# Altium schematic sheet MS1005_Demo_V1.0.SchDoc
size A2; SheetNumber: 0; SheetTotal: 0; PageSetup: Record=PageOptions|CenterHorizontal=False|CenterVertical=True|PrintScale=1.00|XCorrection=1.00|YCorrection=1.00|PrintKind=2|BorderSize=5000000|LeftOffset=0|BottomOffset=0|Orientation=1|PaperLength=1000|PaperWidth=1000|Scale=100|PaperSource=7|PrintQuality=600|MediaType=1|DitherType=10|PaperKind=信纸¦PrintScaleMode=0
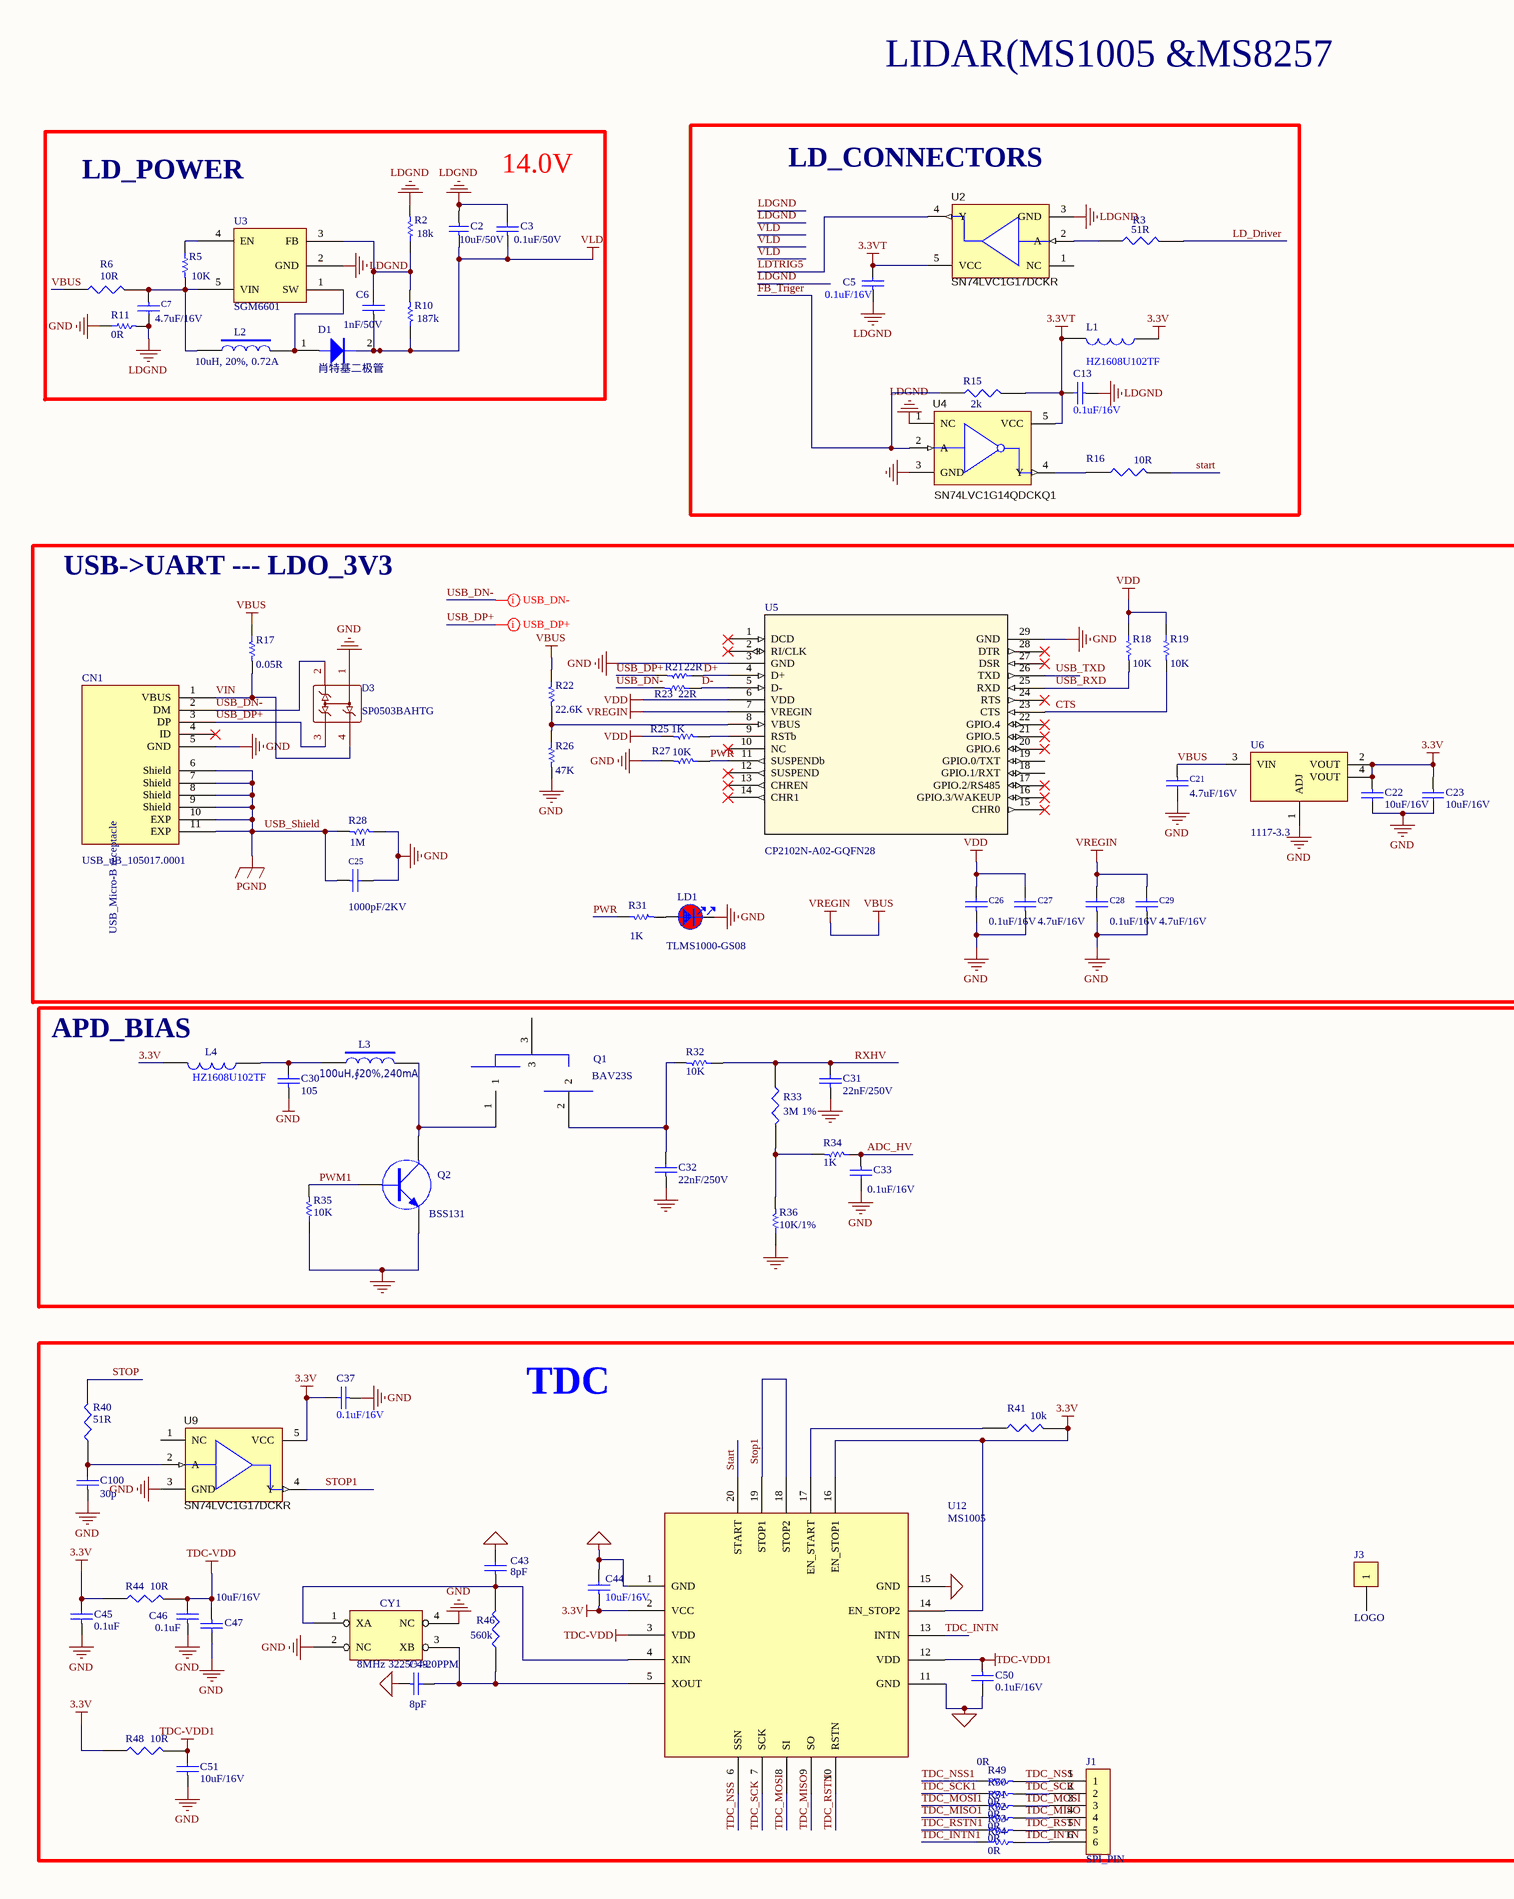
[diagram p0: MS1005_Demo_V1.0.SchDoc, left]
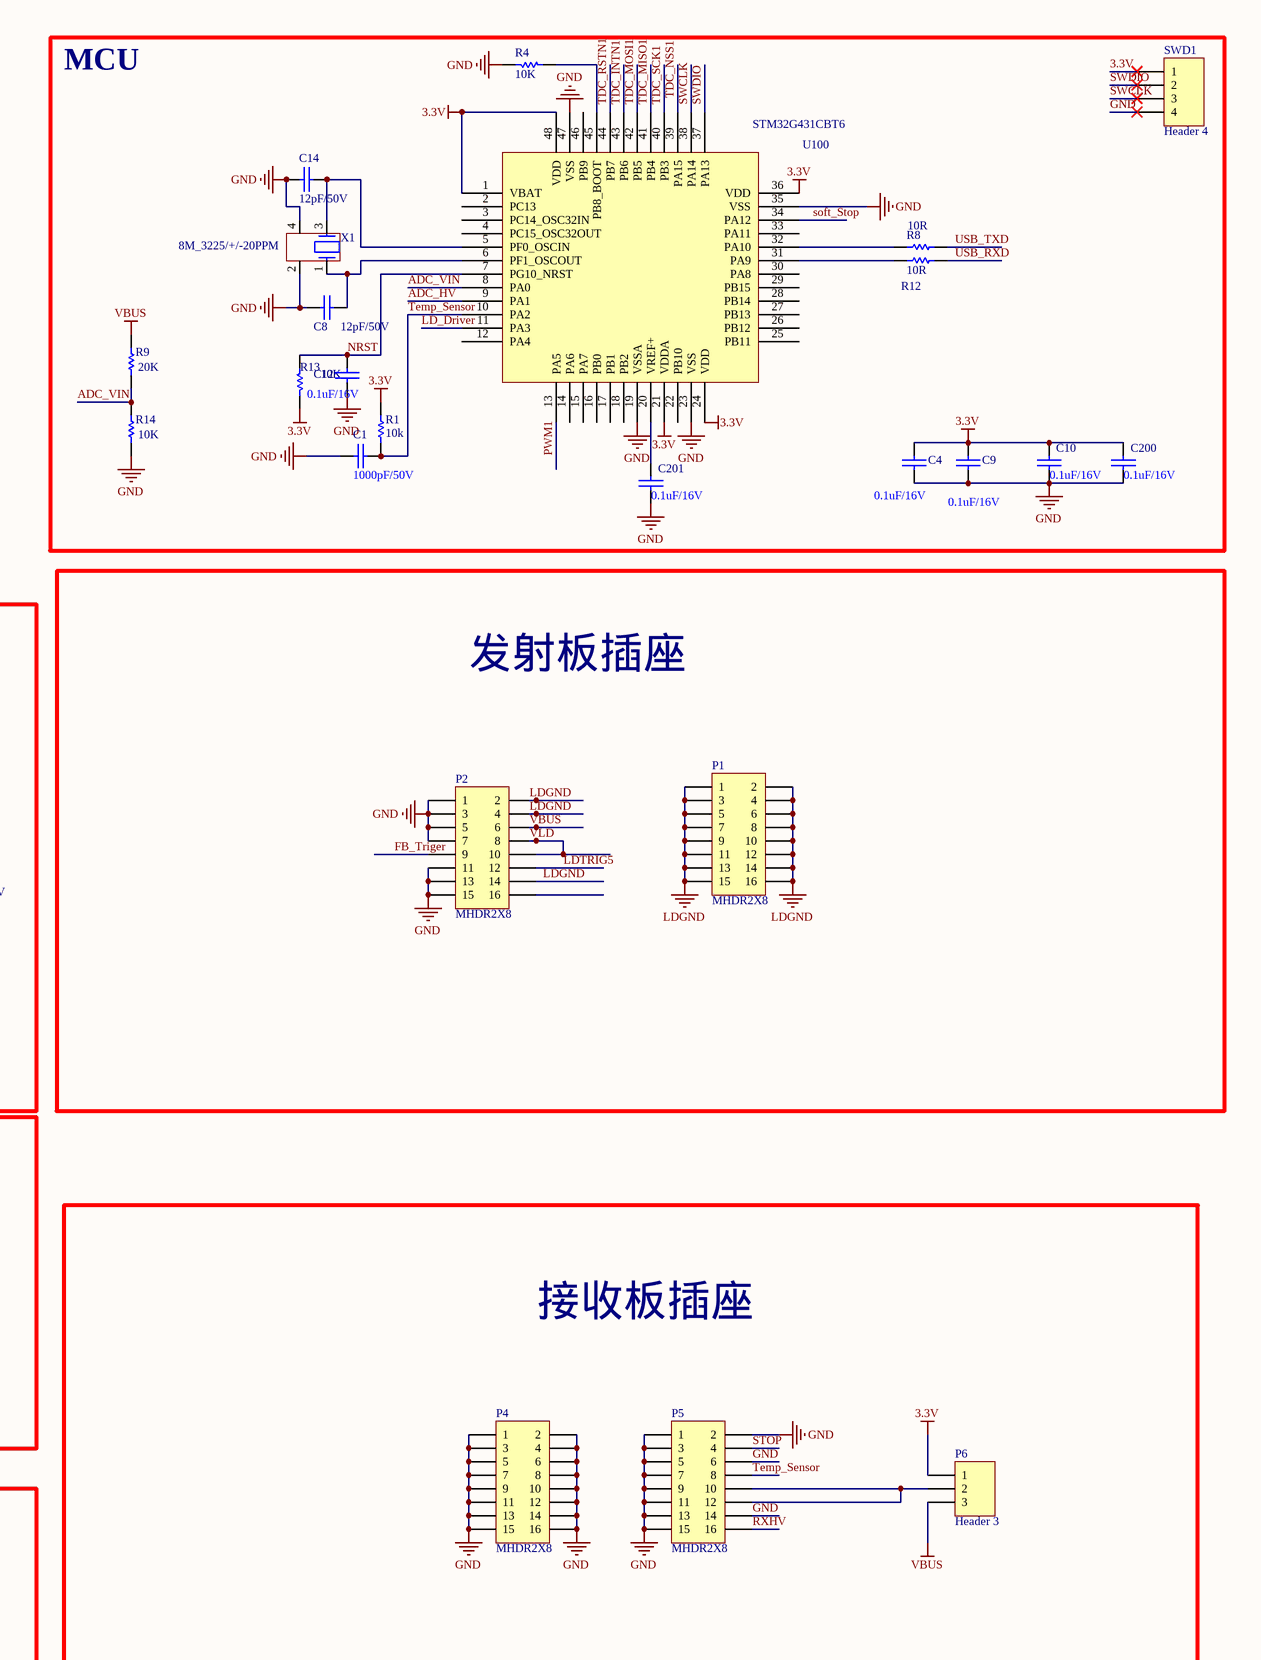
[diagram p1: MS1005_Demo_V1.0.SchDoc, right]

## Parts
C1  1000pF/50V  [C 0402_L]
C2  10uF/50V  [C 0805_L]
C3  0.1uF/50V  [C 0402_L]
C4  0.1uF/16V  [C 0402_L]
C5  0.1uF/16V  [C 0402_L]
C6  1nF/50V  [C 0402_L]
C7  4.7uF/16V  [C 0603_L]
C8  12pF/50V  [C 0402_L]
C9  0.1uF/16V  [C 0402_L]
C10  0.1uF/16V  [C 0402_L]
C12  0.1uF/16V  [C 0402_L]
C13  0.1uF/16V  [C 0402_L]
C14  12pF/50V  [C 0402_L]
C21  4.7uF/16V  [C 0603_L]
C22  10uF/16V  [C 0805_M]
C23  10uF/16V  [C 0603_L]
C25  value 1000pF/2KV  [C 1206_L]  (hidden comment: CC1206KKX7RDBB102)
C26  value 0.1uF/16V  [C 0402_L]  (hidden comment: AC0402KRX7R7BB104)
C27  value 4.7uF/16V  [C 0402_L]  (hidden comment: GRM188Z71C475KE21D)
C28  value 0.1uF/16V  [C 0402_L]  (hidden comment: AC0402KRX7R7BB104)
C29  value 4.7uF/16V  [C 0603_L]  (hidden comment: GRM188Z71C475KE21D)
C30  105  [C 0603_L]
C31  22nF/250V  [C 0805_L]
C32  22nF/250V  [C 0805_L]
C33  0.1uF/16V  [C 0402_L]
C37  0.1uF/16V  [C 0402_L]
C43  8pF  [C 0402_L]
C44  10uF/16V  [C 0805_L]
C45  0.1uF  [C 0402_L]
C46  0.1uF  [C 0402_L]
C47  10uF/16V  [C 0805_L]
C49  8pF  [C 0402_L]
C50  0.1uF/16V  [C 0402_L]
C51  10uF/16V  [C 0805_L]
C100  30p  [0402-A]
C200  0.1uF/16V  [C 0402_L]
C201  0.1uF/16V  [C 0402_L]
CN1  value USB_uB_105017.0001  [CON_USBMICROB_MOLEX_105017-0001_H2P90]  (hidden comment: 1050170001)
CY1  8MHz 3225/+/-20PPM  [OSC 4025-4P]
D1  肖特基二极管  [SOD-323]
D3  SP0503BAHTG  [SOT-143_L]
J1  SPI_PIN  [HDR2.54-LI-6P]
J3  LOGO  [RELMON2]
L1  HZ1608U102TF  [L 0603]
L2  10uH, 20%, 0.72A  [SWPA4020S]
L3  100uH,∮20%,240mA  [SWPA3015S]
L4  HZ1608U102TF  [L 0603]
LD1  TLMS1000-GS08  [LED 0603G]
P1  MHDR2X8  [HDR2.54-M-LS-2x8P]
P2  MHDR2X8  [HDR2.54-M-LS-2x8P]
P4  MHDR2X8  [HDR2.54-M-LS-2x8P]
P5  MHDR2X8  [HDR2.54-M-LS-2x8P]
P6  Header 3  [HDR1X3]
Q1  BAV23S  [SOT-23]
Q2  BSS131  [SOT23NPN]
R1  10k  [0402R]
R2  18k  [0402R]
R3  51R  [0603R]
R4  10K  [0402R]
R5  10K  [0402R]
R6  10R  [0402R]
R8  10R  [0402R]
R9  20K  [0402R]
R10  187k  [0402R]
R11  0R  [0603R]
R12  10R  [0402R]
R13  10K  [0402R]
R14  10K  [0402R]
R15  2k  [0402R]
R16  10R  [0402R]
R17  value 0.05R  [1206R]  (hidden comment: RL1206FR-070R05L)
R18  value 10K  [0402R]  (hidden comment: RC0402FR-0710KL)
R19  value 10K  [0402R]  (hidden comment: RC0402FR-0710KL)
R21  value 22R  [0402R]  (hidden comment: RC0402JR-0722RL)
R22  value 22.6K  [0402R]  (hidden comment: RC0402FR-0722K6L)
R23  value 22R  [0402R]  (hidden comment: RC0402JR-0722RL)
R25  value 1K  [0402R]  (hidden comment: RC0402FR-071KL)
R26  value 47K  [0402R]  (hidden comment: RC0402FR-0747KL)
R27  value 10K  [0402R]  (hidden comment: RC0402FR-0710KL)
R28  value 1M  [0805R]  (hidden comment: RC0805JR-071ML)
R31  value 1K  [0402R]  (hidden comment: RC0402FR-071KL)
R32  10K  [0402R]
R33  3M 1%  [R 0805_L]
R34  1K  [0402R]
R35  10K  [0402R]
R36  value 10K/1%  [0402R]  (hidden comment: 10K)
R40  51R  [0402R]
R41  10k  [0402R]
R44  10R  [0402R]
R46  560k  [0402R]
R48  10R  [0402R]
R49  0R  [0402R]
R50  0R  [0402R]
R51  0R  [0402R]
R52  0R  [0402R]
R53  0R  [0402R]
R54  0R  [0402R]
SWD1  Header 4  [HDR2.54-LI-4P]
U2  SN74LVC1G17DCKR  [SOT323-5]
U3  SGM6601  [SOT23-5]
U4  SN74LVC1G14QDCKQ1  [SOT323-5]
U5  CP2102N-A02-GQFN28  [QFN28_5X5_SIL]
U6  1117-3.3  [SOT-223]
U9  SN74LVC1G17DCKR  [SOT323-5]
U12  MS1005  [QFN20 4x4_1]
U100  STM32G431CBT6  [LQFP-48_M]
X1  value 8M_3225/+/-20PPM  [OSC 4025-4P]  (hidden comment: XTAL_4_PINS)

## Blocks framed on the sheet
MCU: C1 C4 C8-C10 C12 C14 C200 C201 R1 R4 R8 R9 R12-R14 SWD1 U100 X1
LD_CONNECTORS: C5 C13 L1 R3 R15 R16 U2 U4
USB->UART --- LDO_3V3: C21-C23 C25-C29 CN1 D3 LD1 R17-R19 R21-R23 R25-R28 R31 U5 U6
发射板插座: P1 P2
APD_BIAS: C30-C33 L3 L4 Q1 Q2 R32-R36
接收板插座: P4-P6
TDC: C37 C43-C47 C49-C51 C100 CY1 J1 J3 R40 R41 R44 R46 R48-R54 U9 U12

## Nets
3.3V: C4.1 C9.1 C10.2 C22.1 C23.1 C37.2 C44.1 C45.2 C200.2 L1.1 L4.2 P6.1 R1.2 R13.1 R41.2 R44.1 R48.1 SWD1.1 U6.2(VOUT) U6.4(VOUT) U9.5(VCC) U12.2(VCC) U12.14(EN_STOP2) U12.16(EN_STOP1) U100.1(VBAT) U100.21(VDDA) U100.24(VDD) U100.36(VDD) U100.48(VDD)
3.3VT: C5.2 C13.2 L1.2 R15.2 U2.5(VCC) U4.5(VCC)
GND: C1.2 C4.2 C8.2 C9.2 C10.1 C12.1 C14.1 C21.2 C22.2 C23.2 C25.2 C26.1 C27.1 C28.1 C29.1 C30.1 C31.1 C32.1 C33.2 C37.1 C43.2 C44.2 C45.1 C46.1 C47.2 C49.1 C50.2 C51.1 C100.1 C200.1 C201.1 CN1.5(GND) CY1.2(NC) CY1.4(NC) D3.1 LD1.2 P2.1 P2.3 P2.5 P2.7 P2.11 P2.13 P2.15 P4.1 P4.2 P4.3 P4.4 P4.5 P4.6 P4.7 P4.8 P4.9 P4.10 P4.11 P4.12 P4.13 P4.14 P4.15 P4.16 P5.1 P5.2 P5.3 P5.5 P5.6 P5.7 P5.9 P5.11 P5.13 P5.14 P5.15 Q2.3(E) R4.2 R11.1 R14.1 R26.2 R27.2 R28.1 R35.1 R36.1 SWD1.4 U5.3(GND) U5.29(GND) U6.1(ADJ) U9.3(GND) U12.1(GND) U12.11(GND) U12.15(GND) U100.19(VSSA) U100.23(VSS) U100.35(VSS) U100.47(VSS) X1.2 X1.4
LDGND: C2.2 C3.2 C5.1 C7.2 C13.1 P1.1 P1.2 P1.3 P1.4 P1.5 P1.6 P1.7 P1.8 P1.9 P1.10 P1.11 P1.12 P1.13 P1.14 P1.15 P1.16 P2.2 P2.4 P2.14 R2.2 R11.2 U2.3(GND) U3.2(GND) U4.1(NC) U4.3(GND)
TDC-VDD: C46.2 C47.1 R44.2 U12.3(VDD)
TDC-VDD1: C50.1 C51.2 R48.2 U12.12(VDD)
USB_Shield: C25.1 CN1.6(Shield) CN1.7(Shield) CN1.8(Shield) CN1.9(Shield) CN1.10(EXP) CN1.11(EXP) R28.2  [also labelled PGND]
VBUS: C21.1 C28.2 C29.2 P2.6 P6.3 R6.1 R9.2 R17.1 R22.1 U5.7(VREGIN) U6.3(VIN)  [also labelled VREGIN]
VDD: C26.2 C27.2 R18.1 R19.1 R25.2 U5.6(VDD)
VLD: C2.1 C3.1 C6.1 D1.2(K) P2.8 P2.10 R10.1
ADC_HV: C33.1 R34.1 U100.9(PA1)
ADC_VIN: R9.1 R14.2 U100.8(PA0)
CTS: R19.2 U5.23(CTS)
D+: R21.1 U5.4(D+)
D-: R23.1 U5.5(D-)
FB_Triger: P2.9 R15.1 U4.2(A)
LD_Driver: R3.2 U100.11(PA3)
LDTRIG5: P2.12 U2.4(Y)
NRST: C12.2 R13.2 U100.7(PG10_NRST)
PWM1: Q2.1(B) R35.2 U100.13(PA5)
PWR: R27.1 R31.1 U5.11(SUSPENDb)
RXHV: C31.2 P5.16 R32.1 R33.1
soft_Stop: U100.34(PA12)
Start: R16.2 U12.20(START)
STOP: P5.4 R40.2
Stop1: U9.4(Y) U12.18(STOP2) U12.19(STOP1)
SWCLK: SWD1.3 U100.38(PA14)
SWDIO: SWD1.2 U100.37(PA13)
TDC_INTN: J1.6 R54.2 U12.13(INTN)
TDC_INTN1: R54.1 U100.43(PB6)
TDC_MISO: J1.4 R52.2 U12.9(SO)
TDC_MISO1: R52.1 U100.41(PB4)
TDC_MOSI: J1.3 R51.2 U12.8(SI)
TDC_MOSI1: R51.1 U100.42(PB5)
TDC_NSS: J1.1 R49.2 U12.6(SSN)
TDC_NSS1: R49.1 U100.39(PA15)
TDC_RSTN: J1.5 R53.2 U12.10(RSTN)
TDC_RSTN1: R53.1 U100.44(PB7)
TDC_SCK: J1.2 R50.2 U12.7(SCK)
TDC_SCK1: R50.1 U100.40(PB3)
Temp_Sensor: C1.1 P5.8 R1.1 U100.10(PA2)
USB_DN-: CN1.2(DM) D3.2 R23.2
USB_DP+: CN1.3(DP) D3.3 R21.2
USB_RXD: R12.1 R18.2 U5.25(RXD)
USB_TXD: R8.1 U5.26(TXD)
VIN: CN1.1(VBUS) D3.4 R17.2
NetC6_2: C6.2 R2.1 R10.2 U3.3(FB)
NetC7_1: C7.1 L2.1 R5.2 R6.2 U3.5(VIN)
NetC8_1: C8.1 U100.6(PF1_OSCOUT) X1.1
NetC14_2: C14.2 U100.5(PF0_OSCIN) X1.3
NetC30_2: C30.2 L3.1 L4.1
NetC32_2: C32.2 Q1.2 R32.2
NetC43_1: C43.1 CY1.1(XA) R46.2 U12.4(XIN)
NetC49_2: C49.2 CY1.3(XB) R46.1 U12.5(XOUT)
NetC100_2: C100.2 R40.1 U9.2(A)
NetC201_2: C201.2 U100.20(VREF+)
NetD1_1: D1.1(A) L2.2 U3.1(SW)
NetL3_2: L3.2 Q1.1 Q2.2(C)
NetLD1_1: LD1.1 R31.2
NetP5_10: P5.10 P5.12 P6.2
NetR3_1: R3.1 U2.2(A)
NetR4_1: R4.1 U100.45(PB8_BOOT)
NetR5_1: R5.1 U3.4(EN)
NetR8_2: R8.2 U100.32(PA10)
NetR12_2: R12.2 U100.31(PA9)
NetR16_1: R16.1 U4.4(Y)
NetR22_2: R22.2 R26.1 U5.8(VBUS)
NetR25_1: R25.1 U5.9(RSTb)
NetR33_2: R33.2 R34.2 R36.2
NetR41_1: R41.1 U12.17(EN_START)

Not connected (* = marked no-connect by the designer): CN1 4(ID)*; J3 1; P2 16; Q1 3; U2 1(NC); U5 1(DCD)* 2(RI/CLK)* 10(NC)* 12(SUSPEND)* 13(CHREN)* 14(CHR1)* 15(CHR0)* 16(GPIO.3/WAKEUP)* 17(GPIO.2/RS485)* 18(GPIO.1/RXT) 19(GPIO.0/TXT) 20(GPIO.6)* 21(GPIO.5)* 22(GPIO.4)* 24(RTS)* 27(DSR)* 28(DTR)*; U9 1(NC); U100 2(PC13) 3(PC14_OSC32IN) 4(PC15_OSC32OUT) 12(PA4) 14(PA6) 15(PA7) 16(PB0) 17(PB1) 18(PB2) 22(PB10) 25(PB11) 26(PB12) 27(PB13) 28(PB14) 29(PB15) 30(PA8) 33(PA11) 46(PB9)

## Layout directives
USB_DP: True: USB_DP+
USB_DN: True: USB_DN-

## Notes on the sheet
- LIDAR(MS1005 &MS8257
- LD_POWER
- 14.0V
- 主题
- MS1005&MS8257N Demo
- 文件编号
- RM20221206
- 杭州瑞盟科技股份有限公司
- 拟   稿
- 马凌超
- 版 本 号
- V1.0
- 技术文件
- 审   核
- 批   准
- 罗印龙
- 张佳一
- 发布日期
- 页   号
- 2022\8\25
- 1
- (in symbol USB_uB_105017.0001) USB_Micro-B receptacle

## Library data of the parts
C1 = CAP: 0.1uF, 0402, 16V, X7R, 10%; Value: 0.1uF/16V; Package: C 0402_L
C2 = Cap: 10uF, 0805, 50V, X5R, 10 %; Value: 10uF/50V; Package: C 0805_L
C3 = CAP: 0.1uF, 0402, 50V, X7R, 10%; Value: 0.1uF/50V; Package: C 0402_L
C4 C5 C9 C10 C12 C13 C33 C37 C200 C201 = CAP: 0.1uF, 0402, 16V, X7R, 10%; Package: C 0402_L; Value: 0.1uF/16V
C6 = CAP: 1nF, 0402, 50V, X7R, 10%; Package: C 0402_L; Value: 1nF/50V
C7 C21 = CAP: 4.7uF, 0603, 16V, X7R, 10%; Value: 4.7uF/16V; Package: C 0603_L
C8 C14 = CAP: 12pF, 0402, 50V, NPO, 5%; Package: C 0402_L; Value: 12pF/50V
C22 = CAP: 10uF, 0805, 16V, X7R, 10%; Value: 1uF/16V; Package: C 0402_L
C23 C30 = CAP: Capacitor
C25 = CAP: 1000pF, 1206, 2KV, X7R, 10%; Manufacturer: YAGEO; Package: C 0402_L; PartNumber: CC1206KKX7RDBB102
C26 C28 = CAP: 0.1uF, 0402, 16V, X7R, 10%; TN_PartNumber: ECC0402K1E104; Manufacturer: YAGEO; Package: C 0402_L; PartNumber: AC0402KRX7R7BB104
C27 C29 = CAP: 4.7uF, 0603, 16V, X7R, 10%; TN_PartNumber: ECC0603K1E475; Manufacturer: Murata; Package: C 0603_L; PartNumber: GRM188Z71C475KE21D
C31 C32 = CAP: 22nF, 0805, 250V, X7R, 10%
C43 C49 = CAP: 8pF, 0402, 16V, NPO, 5%
C44 C47 C51 = CAP: 10uF, 0805, 16V, X5R, 10%; Value: 10uF/16V
C45 C46 C50 C100 = CAP: 10uF, 0805, 16V, X5R, 10%; Value: 10uF/16V
CN1 = USB_uB_105017.0001: Conn.; Data; USB; Recept.; Micro; B Type; Bottom Mount, SMT, with Solder Tabs, Lead-Free; Manufacturer: MOLEX; Package: CON_USBMICROB_MOLEX_105017-0001_H2P90; PartNumber: 1050170001
CY1 = CRYSTAL: SMD3225, 8MHz, 12pF 10%; Value: 8MHz
D1 = DIODE: Value: CMDZ10L
D3 = SP0503BAHTG: SP050xBA Series 8.5 V 30 pF Triple Uni-Directional TVS Avalanche Diode-SOT143-4; Manufacturer: Littelfuse; Package: SOT-143-L; Value: SP0503BAHTG; PartNumber: SP0503BAHTG
J3 = CON1: Connector
L1 L4 = INDUCTOR: Manufacturer: 顺络; Package: L 0603; PartNumber: HZ1608U102TF; Value: HZ1608U102TF
L2 = INDUCTOR2: SWPA4020100MT; PartNumber: SWPA3015S100MT; Manufacturer: 顺络; Package: SWPA3015S; Value: 10uH, 20%, 0.72A
L3 = INDUCTOR2: SWPA3015S100MT; Value: 100uH,∮20%,240mA
LD1 = LED_red: LED Uni-Color Red 640nm Automotive 2-Pin Chip 0603(1608Metric) T/R; Manufacturer: Vishay; Value: TLMS1000-GS08; Package: LED 0603; PartNumber: TLMS1000-GS08; Alterate Manufacter: Vishay; Alterate PartNumber: TLMS1000-GS08
P1 P2 P4 P5 = MHDR2X8: Header, 8-Pin, Dual row; LatestRevisionDate: 17-Jul-2002; LatestRevisionNote: Re-released for DXP Platform.; Publisher: Altium Limited
P6 = Header 3: Header, 3-Pin; LatestRevisionDate: 17-Jul-2002; LatestRevisionNote: Re-released for DXP Platform.; Publisher: Altium Limited
Q1 = 1SS306: Value: BAV23S
Q2 = NPN: Value: BSS131
R1 = Res1: 10k, 0402, 1%, 1/16W; Value: 10k; Package: R 0402_L
R2 = Res1: 18k, 0402, 1%, 1/16W; Value: 18k; Package: R 0402_L
R3 = RES1
R4 R13 = RES1: 10K, 0402, 1%, 1/16W; Value: 10K; Package: R 0402_L
R5 R14 R32 R35 R36 R49-R54 = Res1: 10K, 0402, 1%, 1/16W; Package: R 0402_L
  R5 R14 R32 R35 R49-R54: Value: 10K
R6 R16 R44 R48 = RES1: 10ohm, 0402, 1%, 1/16W; Value: 10R
R8 R9 R12 = Res1: 20K, 0402, 1%, 1/16W; Value: 20K; Package: R 0402_L
R10 = Res1: 187k, 0402, 1%, 1/16W; Value: 187k; Package: R 0402_L
R11 = Res1: 0ohm, 0603, 5%, 1/16W; Value: 0R; Package: R 0603_L
R15 = RES1: 2k, 0402, 1%, 1/16W; Value: 2k; Package: R 0402_L
R17 = Res1: 0.05ohm, 1206, 1%, 1/4W; Manufacturer: YAGEO; Package: R 1206_L; PartNumber: RL1206FR-070R05L; Supplier 1: 华秋商城; Supplier Part Number 1: RL1206FR-070R05L; Parameter 1: *
R18 R19 R27 = Res1: 10K, 0402, 1%, 1/16W; TN_PartNumber: ERC0402F1002; Manufacturer: YAGEO; Package: R 0402_L; PartNumber: RC0402FR-0710KL
R21 R23 = Res1: 22ohm, 0402, 5%, 1/16W; Manufacturer: YAGEO; Package: R 0402_L; PartNumber: RC0402JR-0722RL
R22 = Res1: 22.6K, 0402, 1%, 1/16W; Manufacturer: YAGEO; Package: R 0402_L; PartNumber: RC0402FR-0722K6L
R25 R31 = RES1: 1K, 0402, 1%, 1/16W; TN_PartNumber: ERC0402F1001; Manufacturer: YAGEO; Package: R 0402_L; PartNumber: RC0402FR-071KL
R26 = Res1: 47K, 0402, 1%, 1/16W; Manufacturer: YAGEO; Package: R 0402_L; PartNumber: RC0402FR-0747KL
R28 = Res1: 1M, 0805, 5%, 1/8W; Manufacturer: YAGEO; Package: R 0805_L; PartNumber: RC0805JR-071ML
R33 = RES1: 3M, 0805, 1%, 1/4W; Package: R 0805_L
R34 = RES1: 1K, 0402, 1%, 1/16W; Value: 1K; Package: R 0402_L
R40 R41 = RES1: 10ohm, 0402, 1%, 1/16W; Value: 10R
R46 = RES1: 560k, 0402, 1%, 1/16W; Value: 560k
SWD1 = Header 4: SWD, NC; Package: SWD-2.54mm; Value: Header 4
U2 U9 = SN74LVC1G17DCKR: Single 1.65-V to 5.5-V buffer with Schmitt-Trigger inputs, SC70-5; Manufacturer: Texas Instruments; CompType: IC; PartNumber: SN74LVC1G17DCKR; Package: DCK0005A_N; MountType: SMT; Value: SN74LVC1G17DCKR
U3 = SGM6601: SGM6601YTN5G/TR; Manufacturer: 圣邦微; Package: SOT23-5; PartNumber: SGM6601YTN5G/TR; Value: SGM6601
U4 = SN74LVC1G14QDCKQ1: SN74LVC1G14QDCKQ1, SC70-5; Manufacturer: Texas Instruments; PartNumber: SN74LVC1G14QDCKQ1; Package: DCK0005A_N; Value: SN74LVC1G14QDCKQ1
U5 = CP2102N-A02-GQFN28: Full Speed USB to UART Bridge USB 2.0 3.3V Tube Automotive 28-Pin QFN EP; Manufacturer: Silicon Labs; Package: QFN28_5X5_SIL; Value: CP2102N-A02-GQFN28; PartNumber: CP2102N-A02-GQFN28
X1 = XTAL_4_PINS: SMD3225, 8MHz, 12pF 10%; Manufacturer: SJK; PartNumber: 7U08000E12UCG; Package: (2016) 2.0 x 1.6 x 0.45 mm